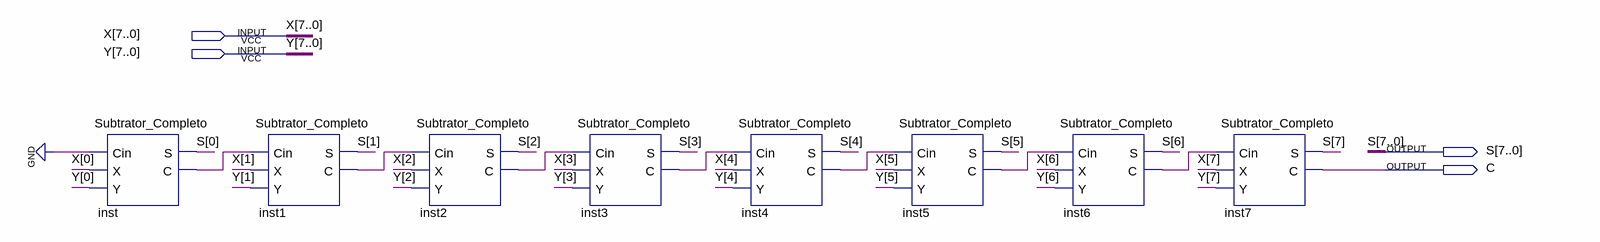
[diagram p0: schematic sheet]
// Quartus schematic Subtrator8B.bdf as structural Verilog: 8 symbols, 4 pins
module Subtrator8B (
  input  [7:0] X,
  input  [7:0] Y,
  output [7:0] S,
  output C
);

  wire inst1_c, inst2_c, inst3_c, inst4_c, inst5_c, inst6_c, inst_c;

  Subtrator_Completo inst (.Cin(1'b0), .X(X[0]), .Y(Y[0]), .S(S[0]), .C(inst_c));
  Subtrator_Completo inst1 (.Cin(inst_c), .X(X[1]), .Y(Y[1]), .S(S[1]), .C(inst1_c));
  Subtrator_Completo inst2 (.Cin(inst1_c), .X(X[2]), .Y(Y[2]), .S(S[2]), .C(inst2_c));
  Subtrator_Completo inst3 (.Cin(inst2_c), .X(X[3]), .Y(Y[3]), .S(S[3]), .C(inst3_c));
  Subtrator_Completo inst4 (.Cin(inst3_c), .X(X[4]), .Y(Y[4]), .S(S[4]), .C(inst4_c));
  Subtrator_Completo inst5 (.Cin(inst4_c), .X(X[5]), .Y(Y[5]), .S(S[5]), .C(inst5_c));
  Subtrator_Completo inst6 (.Cin(inst5_c), .X(X[6]), .Y(Y[6]), .S(S[6]), .C(inst6_c));
  Subtrator_Completo inst7 (.Cin(inst6_c), .X(X[7]), .Y(Y[7]), .S(S[7]), .C(C));
endmodule
